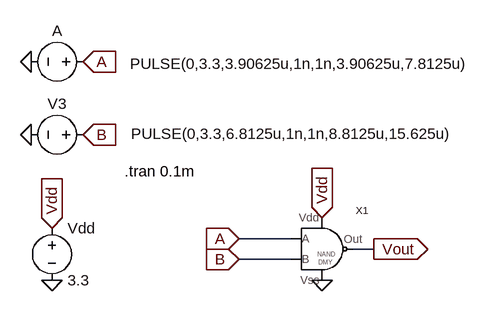
[diagram p0: schematic NAND_test.asc]
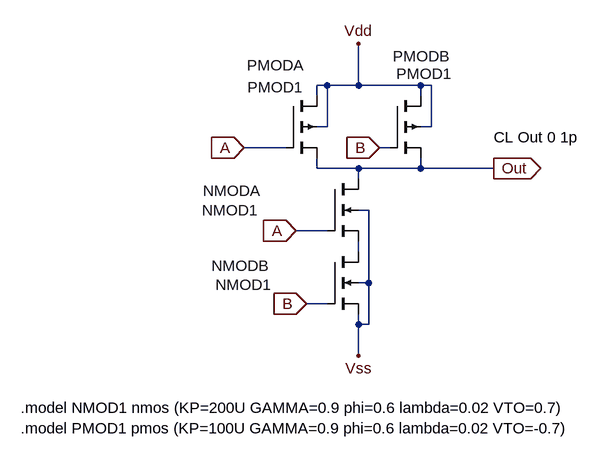
[diagram p1: sub-circuit nand.asc]
NAND_test.asc, the LTspice schematic file:
Version 4
SHEET 1 880 680
WIRE 224 144 144 144
WIRE 352 160 320 160
WIRE 224 176 144 176
FLAG -176 -16 0
FLAG -176 -128 0
FLAG 272 208 0
FLAG -144 208 0
FLAG -96 -128 A
IOPIN -96 -128 In
FLAG -96 -16 B
IOPIN -96 -16 In
FLAG -144 128 Vdd
IOPIN -144 128 In
FLAG 144 144 A
IOPIN 144 144 In
FLAG 144 176 B
IOPIN 144 176 In
FLAG 272 112 Vdd
IOPIN 272 112 In
FLAG 352 160 Vout
IOPIN 352 160 Out
SYMBOL NAND 240 160 R0
SYMATTR InstName X1
SYMBOL voltage -144 112 R0
WINDOW 123 0 0 Left 0
WINDOW 39 0 0 Left 0
SYMATTR InstName Vdd
SYMATTR Value 3.3
SYMBOL voltage -80 -128 R90
WINDOW 0 -32 56 VBottom 2
WINDOW 3 -13 -320 VTop 2
WINDOW 123 0 0 Left 0
WINDOW 39 0 0 Left 0
SYMATTR InstName A
SYMATTR Value PULSE(0,3.3,3.90625u,1n,1n,3.90625u,7.8125u)
SYMBOL voltage -80 -16 R90
WINDOW 0 -32 56 VBottom 2
WINDOW 3 -17 -308 VTop 2
WINDOW 123 0 0 Left 0
WINDOW 39 0 0 Left 0
SYMATTR InstName V3
SYMATTR Value PULSE(0,3.3,6.8125u,1n,1n,8.8125u,15.625u)
TEXT -32 40 Left 2 !.tran 0.1m

nand.asc, the sub-circuit schematic file:
Version 4
SHEET 1 880 680
WIRE 272 -32 256 -32
WIRE 320 -32 320 -96
WIRE 320 -32 272 -32
WIRE 416 -32 320 -32
WIRE 432 -32 416 -32
WIRE 256 -16 256 -32
WIRE 416 -16 416 -32
WIRE 272 32 272 -32
WIRE 272 32 256 32
WIRE 432 32 432 -32
WIRE 432 32 416 32
WIRE 208 64 144 64
WIRE 368 64 352 64
WIRE 256 96 256 80
WIRE 320 96 256 96
WIRE 416 96 416 80
WIRE 416 96 320 96
WIRE 528 96 416 96
WIRE 320 112 320 96
WIRE 336 160 320 160
WIRE 272 192 224 192
WIRE 320 224 320 208
WIRE 336 272 336 160
WIRE 336 272 320 272
WIRE 272 304 240 304
WIRE 320 336 320 320
WIRE 336 336 336 272
WIRE 336 336 320 336
WIRE 320 384 320 336
FLAG 144 64 A
IOPIN 144 64 In
FLAG 224 192 A
IOPIN 224 192 In
FLAG 352 64 B
IOPIN 352 64 In
FLAG 240 304 B
IOPIN 240 304 In
FLAG 528 96 Out
IOPIN 528 96 Out
FLAG 320 384 Vss
FLAG 320 -96 Vdd
SYMBOL pmos4 208 -16 R0
WINDOW 0 -60 -47 Left 2
WINDOW 3 -59 -13 Left 2
SYMATTR InstName PMODA
SYMATTR Value PMOD1
SYMATTR Value2 l=1u w=50u
SYMBOL pmos4 368 -16 R0
WINDOW 0 5 -61 Left 2
WINDOW 3 10 -34 Left 2
SYMATTR InstName PMODB
SYMATTR Value PMOD1
SYMATTR Value2 l=1u w=50u
SYMBOL nmos4 272 112 R0
WINDOW 0 -191 18 Left 2
WINDOW 3 -193 48 Left 2
SYMATTR InstName NMODA
SYMATTR Value NMOD1
SYMATTR Value2 l=1u w=50u
SYMBOL nmos4 272 224 R0
WINDOW 0 -178 22 Left 2
WINDOW 3 -172 51 Left 2
SYMATTR InstName NMODB
SYMATTR Value NMOD1
SYMATTR Value2 l=1u w=100u
TEXT -200 464 Left 2 !.model NMOD1 nmos (KP=200U GAMMA=0.9 phi=0.6 lambda=0.02 VTO=0.7)
TEXT -200 496 Left 2 !.model PMOD1 pmos (KP=100U GAMMA=0.9 phi=0.6 lambda=0.02 VTO=-0.7)
TEXT 528 48 Left 2 !CL Out 0 1p

The netlist it stands for:
* NAND_test.asc
XX1 A B Vout 0 Vdd nand
Vdd Vdd 0 3.3
V§A A 0 PULSE(0,3.3,3.90625u,1n,1n,3.90625u,7.8125u)
V3 B 0 PULSE(0,3.3,6.8125u,1n,1n,8.8125u,15.625u)

* block symbol definitions
.subckt nand A B Out Vss Vdd
M§PMODA Vdd A Out Vdd PMOD1 l=1u w=50u
M§PMODB Vdd B Out Vdd PMOD1 l=1u w=50u
M§NMODA Out A N001 Vss NMOD1 l=1u w=50u
M§NMODB N001 B Vss Vss NMOD1 l=1u w=100u
.model NMOD1 nmos (KP=200U GAMMA=0.9 phi=0.6 lambda=0.02 VTO=0.7)
.model PMOD1 pmos (KP=100U GAMMA=0.9 phi=0.6 lambda=0.02 VTO=-0.7)
CL Out 0 1p
.ends nand

.model NMOS NMOS
.model PMOS PMOS
.lib standard.mos
.tran 0.1m
.backanno
.end

* Results of the author's LTspice run, read from the files saved beside the schematic
* Operating Point, zero values left out:
*   V(vdd) = 3.3 V
*   V(vout) = 3.3 V
*   I(Vdd) = -5.79 pA
*   Ix(x1:OUT) = 1.771 nA
*   Ix(x1:VSS) = -5.79 pA
*   Ix(x1:VDD) = -1.765 nA
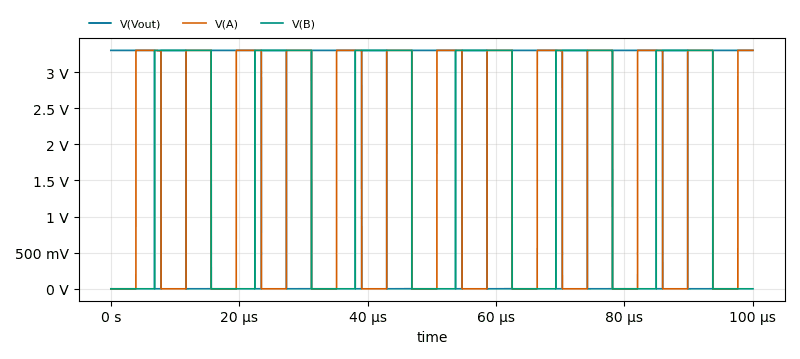
[diagram p2: Transient Analysis of NAND_test.asc, plotted from the saved traces]
* Transient Analysis, 1 run:
*   V(Vout): min 0 V, max 3.3 V, average 2.328 V, rms 2.772 V, last 3.3 V
*   V(A): min 0 V, max 3.3 V, average 1.625 V, rms 2.315 V, last 3.3 V
*   V(B): min 0 V, max 3.3 V, average 1.745 V, rms 2.4 V, last 0 V